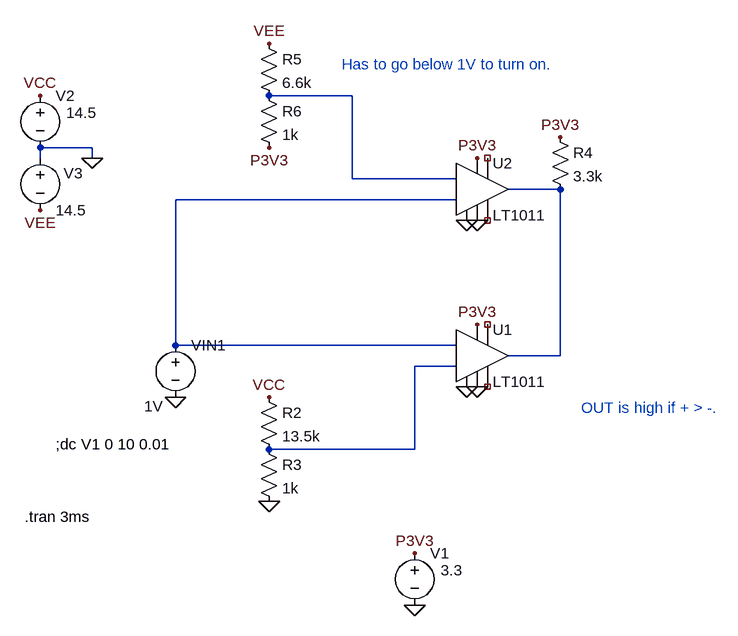
[diagram p0: schematic Draft45.asc]
Draft45.asc, the LTspice schematic file:
Version 4
SHEET 1 1440 868
WIRE -96 -192 -224 -192
WIRE -496 -112 -576 -112
WIRE -576 -96 -576 -112
WIRE -496 -96 -496 -112
WIRE -96 -64 -96 -192
WIRE 64 -64 -96 -64
WIRE 224 -48 144 -48
WIRE 64 -32 -368 -32
WIRE -368 192 -368 -32
WIRE 64 192 -368 192
WIRE 224 208 224 -48
WIRE 224 208 144 208
WIRE 64 224 0 224
WIRE 0 352 0 224
WIRE 0 352 -224 352
FLAG -368 272 0
FLAG -496 -96 0
FLAG -576 -192 VCC
FLAG -576 -16 VEE
FLAG 80 256 0
FLAG 0 512 P3V3
FLAG 0 592 0
FLAG 96 256 0
FLAG -224 272 VCC
FLAG -224 432 0
FLAG 96 160 P3V3
FLAG 96 -96 P3V3
FLAG 80 0 0
FLAG 96 0 0
FLAG 224 -128 P3V3
FLAG -224 -272 VEE
FLAG -224 -112 P3V3
SYMBOL voltage -576 -208 R0
WINDOW 123 0 0 Left 0
WINDOW 39 0 0 Left 0
WINDOW 3 40 42 Left 2
SYMATTR Value 14.5
SYMATTR InstName V2
SYMBOL voltage -576 -112 R0
WINDOW 123 0 0 Left 0
WINDOW 39 0 0 Left 0
WINDOW 0 36 39 Left 2
SYMATTR InstName V3
SYMATTR Value 14.5
SYMBOL voltage -368 176 R0
WINDOW 123 0 0 Left 0
WINDOW 39 0 0 Left 0
WINDOW 3 -48 110 Left 2
SYMATTR Value 1V
SYMATTR InstName VIN1
SYMBOL voltage 0 496 R0
WINDOW 123 0 0 Left 0
WINDOW 39 0 0 Left 0
WINDOW 3 40 42 Left 2
SYMATTR Value 3.3
SYMATTR InstName V1
SYMBOL Comparators\\LT1011 96 208 R0
SYMATTR InstName U1
SYMBOL res -240 256 R0
SYMATTR InstName R2
SYMATTR Value 13.5k
SYMBOL res -240 336 R0
SYMATTR InstName R3
SYMATTR Value 1k
SYMBOL Comparators\\LT1011 96 -48 R0
SYMATTR InstName U2
SYMBOL res 208 -144 R0
SYMATTR InstName R4
SYMATTR Value 3.3k
SYMBOL res -240 -288 R0
SYMATTR InstName R5
SYMATTR Value 6.6k
SYMBOL res -240 -208 R0
SYMATTR InstName R6
SYMATTR Value 1k
TEXT -552 344 Left 2 !;dc V1 0 10 0.01
TEXT -600 456 Left 2 !.tran 3ms
TEXT 256 288 Left 2 ;OUT is high if + > -.
TEXT -112 -240 Left 2 ;Has to go below 1V to turn on.

The netlist it stands for:
* Draft45.asc
V2 VCC 0 14.5
V3 0 VEE 14.5
VIN1 N003 0 1V
V1 P3V3 0 3.3
XU1 0 N004 N003 0 NC_01 NC_02 N002 P3V3 LT1011
R2 VCC N004 13.5k
R3 N004 0 1k
XU2 0 N003 N001 0 NC_03 NC_04 N002 P3V3 LT1011
R4 P3V3 N002 3.3k
R5 VEE N001 6.6k
R6 N001 P3V3 1k
;dc V1 0 10 0.01
.tran 3ms
* OUT is high if + > -.
* Has to go below 1V to turn on.
.lib LTC1.lib
.backanno
.end